# Altium schematic sheet Sheet4.SchDoc
size A4
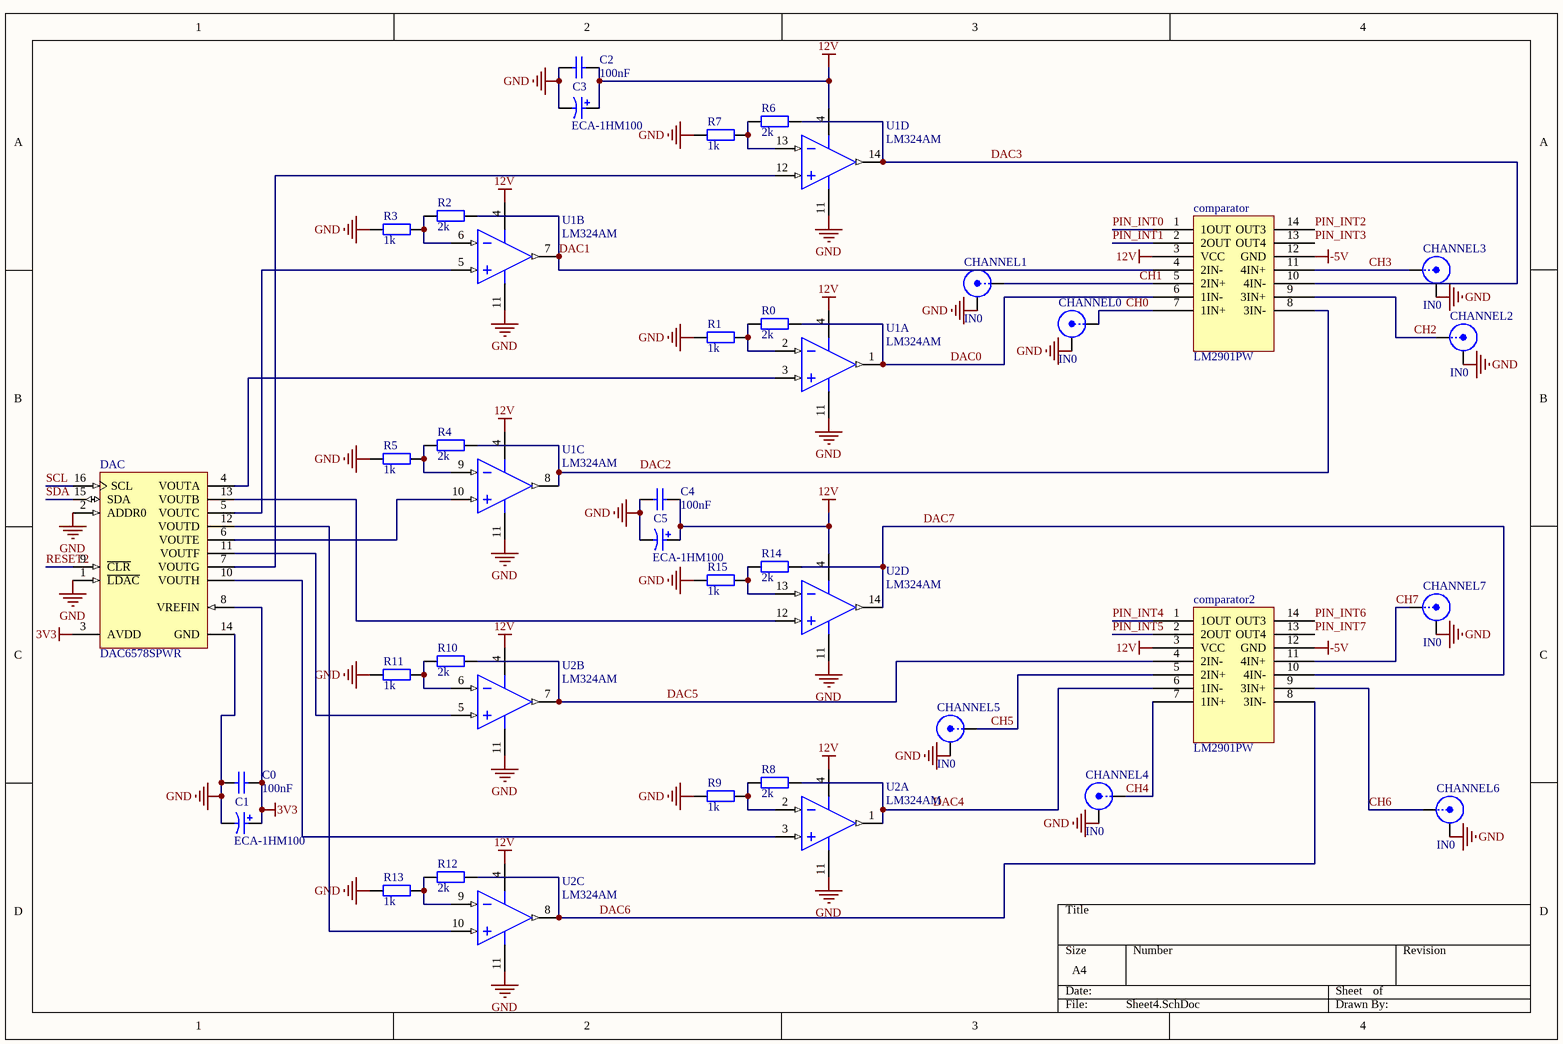
[diagram p0: Sheet4.SchDoc]

## Parts
C0  100nF  [C0805]
C1  ECA-1HM100  [CAPPR55-200-1100X500X1200]
C2  100nF  [C0805]
C3  ECA-1HM100  [CAPPR55-200-1100X500X1200]
C4  100nF  [C0805]
C5  ECA-1HM100  [CAPPR55-200-1100X500X1200]
CHANNEL0  IN0  [SMB]
CHANNEL1  IN0  [SMB]
CHANNEL2  IN0  [SMB]
CHANNEL3  IN0  [SMB]
CHANNEL4  IN0  [SMB]
CHANNEL5  IN0  [SMB]
CHANNEL6  IN0  [SMB]
CHANNEL7  IN0  [SMB]
comparator  LM2901PW  [TSSOP-14]
comparator2  LM2901PW  [TSSOP-14]
DAC  DAC6578SPWR  [TI-PW16_N]
R0  value 2k  [6-0805_N]  (hidden comment: 2k-0W25-0805)
R1  value 1k  [6-0805_N]  (hidden comment: 1k-0W25-0805)
R2  value 2k  [6-0805_N]  (hidden comment: 2k-0W25-0805)
R3  value 1k  [6-0805_N]  (hidden comment: 1k-0W25-0805)
R4  value 2k  [6-0805_N]  (hidden comment: 2k-0W25-0805)
R5  value 1k  [6-0805_N]  (hidden comment: 1k-0W25-0805)
R6  value 2k  [6-0805_N]  (hidden comment: 2k-0W25-0805)
R7  value 1k  [6-0805_N]  (hidden comment: 1k-0W25-0805)
R8  value 2k  [6-0805_N]  (hidden comment: 2k-0W25-0805)
R9  value 1k  [6-0805_N]  (hidden comment: 1k-0W25-0805)
R10  value 2k  [6-0805_N]  (hidden comment: 2k-0W25-0805)
R11  value 1k  [6-0805_N]  (hidden comment: 1k-0W25-0805)
R12  value 2k  [6-0805_N]  (hidden comment: 2k-0W25-0805)
R13  value 1k  [6-0805_N]  (hidden comment: 1k-0W25-0805)
R14  value 2k  [6-0805_N]  (hidden comment: 2k-0W25-0805)
R15  value 1k  [6-0805_N]  (hidden comment: 1k-0W25-0805)
U1  LM324AM  [D0014A_N]  (parts A,B,C,D of 4)
U2  LM324AM  [D0014A_N]  (parts A,B,C,D of 4)

## Nets
3V3: C0.2 C1.1 DAC.3(AVDD) DAC.8(VREFIN)
12V: C2.2 C3.1 C4.2 C5.1 comparator.3(VCC) comparator2.3(VCC) U1.4(V+) U2.4(V+)
-5V: comparator.12(GND) comparator2.12(GND)
GND: C0.1 C1.2 C2.1 C3.2 C4.1 C5.2 CHANNEL0.2(Y) CHANNEL1.2(Y) CHANNEL2.2(Y) CHANNEL3.2(Y) CHANNEL4.2(Y) CHANNEL5.2(Y) CHANNEL6.2(Y) CHANNEL7.2(Y) DAC.1(~{LDAC}) DAC.2(ADDR0) DAC.14(GND) R1.1 R3.1 R5.1 R7.1 R9.1 R11.1 R13.1 R15.1 U1.11(GND) U2.11(GND)
CH0: CHANNEL0.1(X) comparator.7(1IN+)
CH1: CHANNEL1.1(X) comparator.5(2IN+)
CH2: CHANNEL2.1(X) comparator.9(3IN+)
CH3: CHANNEL3.1(X) comparator.11(4IN+)
CH4: CHANNEL4.1(X) comparator2.7(1IN+)
CH5: CHANNEL5.1(X) comparator2.5(2IN+)
CH6: CHANNEL6.1(X) comparator2.9(3IN+)
CH7: CHANNEL7.1(X) comparator2.11(4IN+)
DAC0: comparator.6(1IN-) R0.2 U1.1(OUT1)
DAC1: comparator.4(2IN-) R2.2 U1.7(OUT2)
DAC2: comparator.8(3IN-) R4.2 U1.8(OUT3)
DAC3: comparator.10(4IN-) R6.2 U1.14(OUT4)
DAC4: comparator2.6(1IN-) R8.2 U2.1(OUT1)
DAC5: comparator2.4(2IN-) R10.2 U2.7(OUT2)
DAC6: comparator2.8(3IN-) R12.2 U2.8(OUT3)
DAC7: comparator2.10(4IN-) R14.2 U2.14(OUT4)
PIN_INT0: comparator.1(1OUT)
PIN_INT1: comparator.2(2OUT)
PIN_INT2: comparator.14(OUT3)
PIN_INT3: comparator.13(OUT4)
PIN_INT4: comparator2.1(1OUT)
PIN_INT5: comparator2.2(2OUT)
PIN_INT6: comparator2.14(OUT3)
PIN_INT7: comparator2.13(OUT4)
RESET2: DAC.9(~{CLR})
SCL: DAC.16(SCL)
SDA: DAC.15(SDA)
NetDAC_4: DAC.4(VOUTA) U1.3(IN1+)
NetDAC_5: DAC.5(VOUTC) U1.5(IN2+)
NetDAC_6: DAC.6(VOUTE) U1.10(IN3+)
NetDAC_7: DAC.7(VOUTG) U1.12(IN4+)
NetDAC_10: DAC.10(VOUTH) U2.3(IN1+)
NetDAC_11: DAC.11(VOUTF) U2.5(IN2+)
NetDAC_12: DAC.12(VOUTD) U2.10(IN3+)
NetDAC_13: DAC.13(VOUTB) U2.12(IN4+)
NetR0_1: R0.1 R1.2 U1.2(IN1-)
NetR2_1: R2.1 R3.2 U1.6(IN2-)
NetR4_1: R4.1 R5.2 U1.9(IN3-)
NetR6_1: R6.1 R7.2 U1.13(IN4-)
NetR8_1: R8.1 R9.2 U2.2(IN1-)
NetR10_1: R10.1 R11.2 U2.6(IN2-)
NetR12_1: R12.1 R13.2 U2.9(IN3-)
NetR14_1: R14.1 R15.2 U2.13(IN4-)

## Library data of the parts
C0 C2 C4 = Ceramic 100nF/50V: Capacitor Cer 50V 0805 Vishay X7R; PackageReference: 0805; Supplier 1: Farnell; Supplier Part Number 1: 1612208; Value: 100nF
C1 C3 C5 = CMP-1665-00038-1: Aluminum Electrolytic Capacitor, 10 uF, +/- 20%, 50 V, -40 to 85 degC, 2-Pin THD, RoHS, Bulk; Max Power Dissipation: 625 mW; Min Supply Voltage: 4.5 V; Max Ouput Current: 200 mA; Nominal Supply Current: 10 mA; Case\Package: SOIC; Max Supply Voltage: 16 V; Max Operating Temperature: 70 degC; DatasheetVersion: Mar-16; ComponentLink1URL: http://www.panasonic.com/; Packaging: Tape and Reel; PackageDescription: 2-Pin Radial Lead, Dia 5 mm, Body Length 11 mm; ComponentLink2Description: Datasheet; Mount: Surface Mount; Width: 4 mm; RoHSCompliant: true; Length: 5 mm; Pins: 8; PackageReference: CAPPR55-200-1100X500X1200; ComponentLink1Description: Manufacturer URL; Package Quantity: 2500; ComponentLink2URL: http://industrial.panasonic.com/cdbs/www-data/pdf/RDF0000/DMF0000COL68.pdf; Height: 1.5 mm; Radiation Hardening: No; Min Operating Temperature: 0 degC; Supplier 1: Farnell; Supplier Part Number 1: 9693769
CHANNEL0-CHANNEL7 = SMB: SMB Straight Connector; LatestRevisionDate: 17-Jul-2002; LatestRevisionNote: Re-released for DXP Platform.; Publisher: Altium Limited; Supplier 1: Farnell; Supplier Part Number 1: 1206013
DAC = CMP-0004-01130-1: 10-Bit, Octal Channel, Ultra-Low Glitch, Voltage Output, 2-Wire Interface DAC, -40 to 125 degC, 16-pin SOP (PW16), Green (RoHS & no Sb/Br); Manufacturer: Texas Instruments; DAC Channels: 8; INL(Max)(+/-LSB): 0.5; Power Consumption(Typ)(mW): 3.67; Resolution(Bits): 10; SubFamily: Precision DAC (=<10MSPS); Settling Time(us): 7; Interface: Serial I2C; DatasheetVersion: SBAS496A; ComponentLink3Description: Package Specification; Mounting Technology: Surface Mount; ComponentLink1URL: http://www.ti.com/; ComponentLink2Description: Datasheet; Code_JEDEC: MO-153; ComponentLink2URL: http://www.ti.com/general/docs/lit/getliterature.tsp?genericPartNumber=DAC6578&fileType=pdf; ComponentLink3URL: http://www.ti.com/lit/ml/mpds361/mpds361.pdf; DNL(Max)(+/-LSB): 0.5; PackageReference: PW16; PackageVersion: 4040064-4/G, 02/2011; PackageDescription: 16-Pin Plastic Small Outline, Body 5 x 4.4 mm, Pitch 0.65 mm; Eco-Plan: Green (RoHS & no Sb/Br); PartNumber: DAC6578SPWR; ComponentLink1Description: Manufacturer URL; Supplier 1: Farnell; Supplier Part Number 1: 1854519
R0-R15 = 1k-0W25-0805: Resistor; Published: 8-Jun-2000; LatestRevisionDate: 17-Jul-2002; LatestRevisionNote: Re-released for DXP Platform.; PackageReference: AXIAL-0.4; Publisher: Altium Limited; Supplier 1: Farnell
  R0 R2 R4 R6 R8 R10 R12 R14: Supplier Part Number 1: 2057613
  R1 R3 R5 R7 R9 R11 R13 R15: Supplier Part Number 1: 1750754RL
U1 U2 = CMP-0055-00794-3: Low Power Quad Operational Amplifier, 14-pin Narrow SOIC; Manufacturer: Texas Instruments; PowerWise: N; CompType: Amplifiers; PackageTopMarking: NSUZXYTTE#*LM324AM; ComponentLink1URL: http://www.ti.com/general/docs/lit/getliterature.tsp?genericPartNumber=LM324-N&fileType=pdf; PinCount: 14; Package Reference: D0014A; PackageDescription: Molded Package S.O., .150in Wide, 14 Lead; Code_IPC: SOIC127P600-14; ComponentLink1Description: Datasheet URL; RoHS: N; Code_JEDEC: MS-012AB; PartId: 1; Supplier 1: Farnell; Supplier Part Number 1: 2450779
comparator comparator2 = LM2901PW: Supplier 1: Farnell; Supplier Part Number 1: 2295995